# Altium project 218BProject.PrjPCB
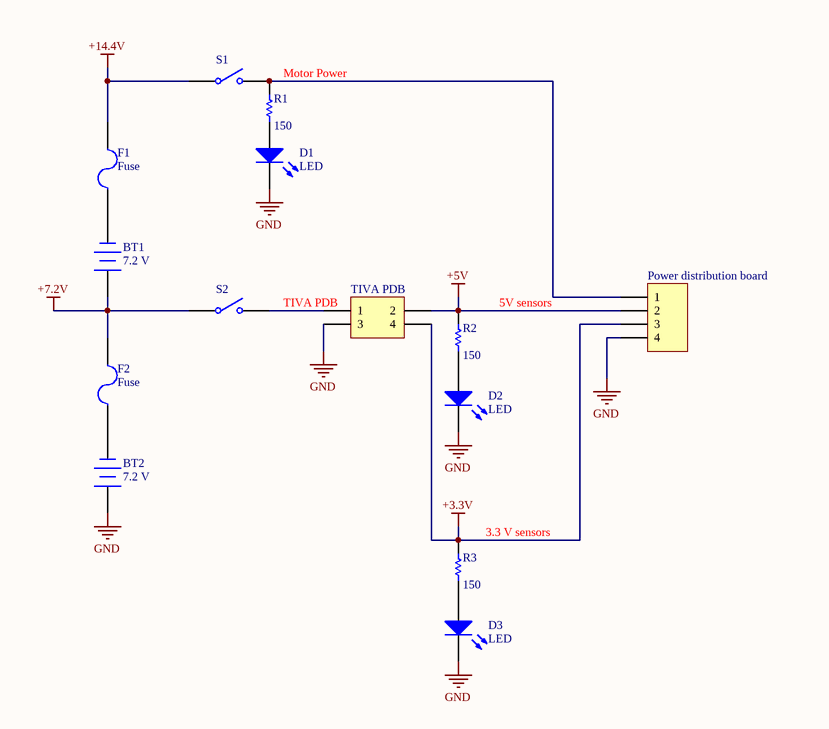
[diagram p0: Battery_supply.SchDoc]
9 sheets, 66 parts. Net scope: flat (ports and power ports of the same name join across sheets).
Sheets:
  Battery_supply.SchDoc
  Motordrive.SchDoc
  TIVA.SchDoc
  Color_sensor.SchDoc
  COMPASS.SchDoc
  Team_indication.SchDoc
  Collision_avoidance.SchDoc
  Moving_balls.SchDoc
  TapeSensing.SchDoc

## Sheet Battery_supply.SchDoc
size A

### Parts
(Parts that share a designator on the sheet are numbered #1, #2 ... from top to bottom, then left to right.)
BT1  7.2 V  [BAT-2]
BT2  7.2 V  [BAT-2]
D1  LED  [LED-1]
D2  LED  [LED-1]
D3  LED  [LED-1]
F1  Fuse  [PIN-W2/E2.8]
F2  Fuse  [PIN-W2/E2.8]
Power_distribution_board  Header 4  [HDR1X4]  (value not drawn)
R1#1  value 150  [AXIAL-0.3]  (hidden comment: Res1)
R2#1  value 150  [AXIAL-0.3]  (hidden comment: Res1)
R3#1  value 150  [AXIAL-0.3]  (hidden comment: Res1)
S1  (no value)  [SPST-2]
S2  (no value)  [SPST-2]
TIVA_PDB  Header 2X2  [HDR2X2]  (value not drawn)

### Nets
+3.3V: Power_distribution_board.3 R3#1.2 TIVA_PDB.4
+5V: Power_distribution_board.2 R2#1.2 TIVA_PDB.2
+7.2V: BT1.1(+) F2.2 S2.1(COMMON)
+14.4V: F1.2 S1.1(COMMON)
GND: BT2.1(+) D1.2(K) D2.2(K) D3.2(K) Power_distribution_board.4 TIVA_PDB.3
NetBT1_2: BT1.2(-) F1.1
NetBT2_2: BT2.2(-) F2.1
NetD2_1: D2.1(A) R2#1.1
NetD3_1: D3.1(A) R3#1.1
NetPower_distribution_board_1: Power_distribution_board.1 R1#1.2 S1.2(NO)
NetS2_2: S2.2(NO) TIVA_PDB.1

Not connected (* = marked no-connect by the designer): D1 1(A); R1#1 1

### Notes on the sheet
- (near R1#1) Motor Power
- (near TIVA_PDB) TIVA PDB
- (near R2#1) 5V sensors
- (near R3#1) 3.3 V sensors

### Library data of the parts
BT1 BT2 = Battery: Multicell Battery; Published: 24-Mar-1999; LatestRevisionDate: 17-Jul-2002; LatestRevisionNote: Re-released for DXP Platform.; PackageReference: BAT-2; Publisher: Altium Limited; PackageDescription: Battery; 2 Leads
D1-D3 = LED1: Typical RED GaAs LED; Published: 8-Jun-2000; LatestRevisionDate: 08-Jul-2005; LatestRevisionNote: Mech Layer 1 removed.; PackageReference: LED-1; Publisher: Altium Limited; PackageDescription: LED; 2 Leads
F1 F2 = Fuse 2: Published: 8-Jun-2000; LatestRevisionDate: 17-Jul-2002; LatestRevisionNote: Re-released for DXP Platform.; PackageReference: PIN-W2/E2.8; Publisher: Altium Limited; PackageDescription: Thru-Hole; 2 Leads
Power_distribution_board = Header 4: Header, 4-Pin; LatestRevisionDate: 17-Jul-2002; LatestRevisionNote: Re-released for DXP Platform.; Publisher: Altium Limited
R1#1 R2#1 R3#1 = Res1: Resistor; Published: 8-Jun-2000; LatestRevisionDate: 17-Jul-2002; LatestRevisionNote: Re-released for DXP Platform.; PackageReference: AXIAL-0.3; Publisher: Altium Limited; PackageDescription: Axial Device, Thru-Hole; 2 Leads; 0.3 in Pin Spacing
S1 S2 = SW-SPST: Single-Pole, Single-Throw Switch; Published: 24-Mar-1999; LatestRevisionDate: 17-Jul-2002; LatestRevisionNote: Re-released for DXP Platform.; PackageReference: SPST-2; Publisher: Altium Limited; PackageDescription: Switch; 2 Leads
TIVA_PDB = Header 2X2: Header, 2-Pin, Dual row; LatestRevisionDate: 17-Jul-2002; LatestRevisionNote: Re-released for DXP Platform.; Publisher: Altium Limited

## Sheet Motordrive.SchDoc
size A
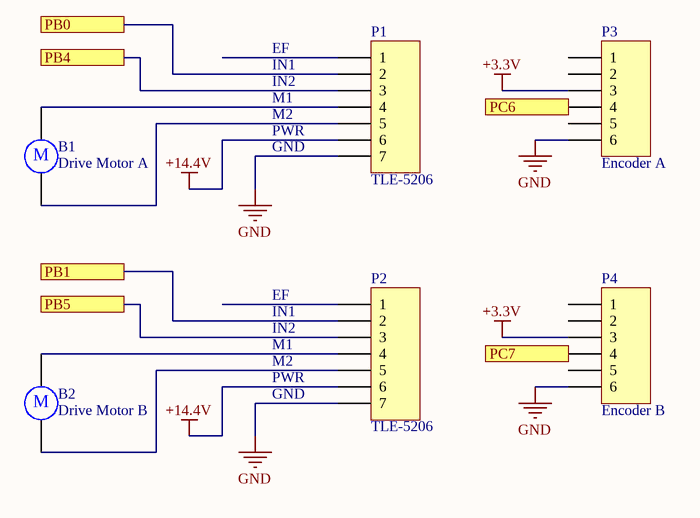
[diagram p1: Motordrive.SchDoc]

### Parts
B1  Drive Motor A  [RB5-10.5]
B2  Drive Motor B  [RB5-10.5]
P1  TLE-5206  [HDR1X7]
P2  TLE-5206  [HDR1X7]
P3  Encoder A  [HDR1X6]
P4  Encoder B  [HDR1X6]

### Ports
PB0, PB1, PB4, PB5, PC6, PC7

### Nets
+3.3V: P3.3 P4.3
+14.4V: P1.6 P2.6
GND: P1.7 P2.7 P3.6 P4.6
NetB1_1: B1.1 P1.4
NetB1_2: B1.2 P1.5
NetB2_1: B2.1 P2.4
NetB2_2: B2.2 P2.5
NetP1_2: P1.2 ; port PB0
NetP1_3: P1.3 ; port PB4
NetP2_2: P2.2 ; port PB1
NetP2_3: P2.3 ; port PB5
NetP3_4: P3.4 ; port PC6
NetP4_4: P4.4 ; port PC7

Not connected (* = marked no-connect by the designer): P1 1; P2 1; P3 1 2 5; P4 1 2 5

### Notes on the sheet
- EF
- IN1
- IN2
- M1
- M2
- PWR
- GND
- (in symbol Motor) M

### Library data of the parts
B1 B2 = Motor: Motor, General Kind; Manufacturer: Generic Components; Published: 1999
P1 P2 = Header 7: Header, 7-Pin; LatestRevisionDate: 17-Jul-2002; LatestRevisionNote: Re-released for DXP Platform.; Publisher: Altium Limited
P3 P4 = Header 6: Header, 6-Pin; LatestRevisionDate: 17-Jul-2002; LatestRevisionNote: Re-released for DXP Platform.; Publisher: Altium Limited

## Sheet TIVA.SchDoc
size A
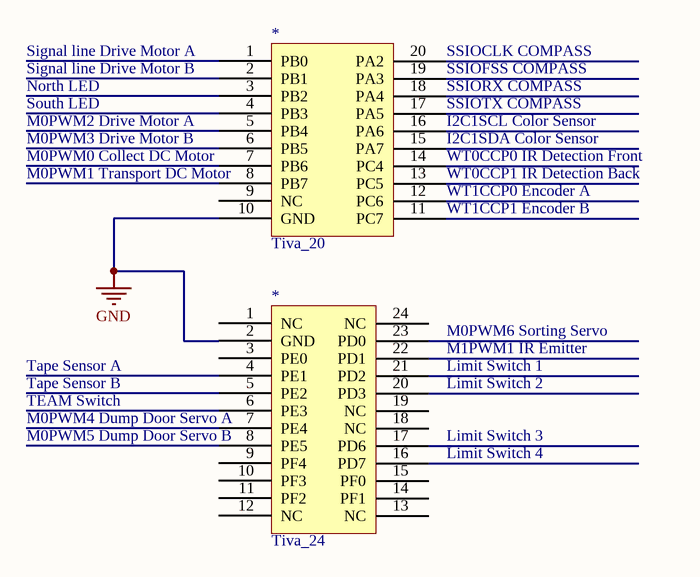
[diagram p2: TIVA.SchDoc]

### Parts
(Parts that share a designator on the sheet are numbered #1, #2 ... from top to bottom, then left to right.)
*#1  Tiva_20
*#2  Tiva_24

### Nets
GND: *#1.10(GND) *#2.2(GND)

Not connected (* = marked no-connect by the designer): *#1 1(PB0) 2(PB1) 3(PB2) 4(PB3) 5(PB4) 6(PB5) 7(PB6) 8(PB7) 9(NC) 11(PC7) 12(PC6) 13(PC5) 14(PC4) 15(PA7) 16(PA6) 17(PA5) 18(PA4) 19(PA3) 20(PA2); *#2 1(NC) 3(PE0) 4(PE1) 5(PE2) 6(PE3) 7(PE4) 8(PE5) 9(PF4) 10(PF3) 11(PF2) 12(NC) 13(NC) 14(PF1) 15(PF0) 16(PD7) 17(PD6) 18(NC) 19(NC) 20(PD3) 21(PD2) 22(PD1) 23(PD0) 24(NC)

### Notes on the sheet
- (near *#1) Signal line Drive Motor A
- (near *#1) Signal line Drive Motor B
- North LED
- (near *#1) SSIORX COMPASS
- (near *#1) SSIOFSS COMPASS
- (near *#1) SSIOCLK COMPASS
- South LED
- M0PWM2 Drive Motor A
- M0PWM3 Drive Motor B
- (near *#1) M0PWM0 Collect DC Motor
- (near *#1) M0PWM1 Transport DC Motor
- (near *#1) WT0CCP1 IR Detection Back
- (near *#1) WT0CCP0 IR Detection Front
- (near *#1) I2C1SDA Color Sensor
- (near *#1) SSIOTX COMPASS
- (near *#1) I2C1SCL Color Sensor
- (near *#1) WT1CCP1 Encoder B
- (near *#1) WT1CCP0 Encoder A
- M0PWM6 Sorting Servo
- M1PWM1 IR Emitter
- (near *#2) M0PWM4 Dump Door Servo A
- (near *#2) M0PWM5 Dump Door Servo B
- Tape Sensor A
- Tape Sensor B
- TEAM Switch
- Limit Switch 1
- Limit Switch 2
- Limit Switch 3
- Limit Switch 4

### Library data of the parts
*#1 = Tiva_20: Tiva Protection 20 Pin Connector
*#2 = Tiva_24: Tiva Protection 24 Pin Connector

## Sheet Color_sensor.SchDoc
size A
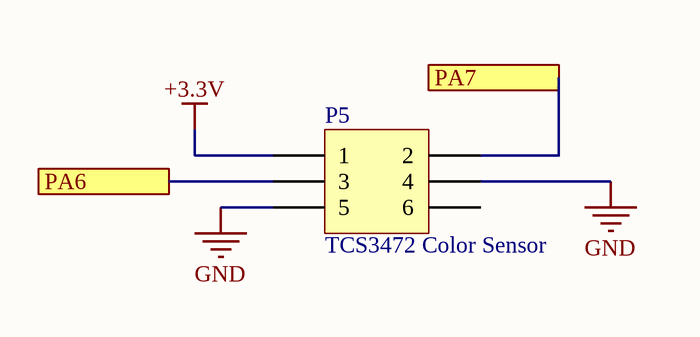
[diagram p3: Color_sensor.SchDoc]

### Parts
P5  TCS3472 Color Sensor  [HDR2X3]

### Ports
PA6, PA7

### Nets
+3.3V: P5.1
GND: P5.4 P5.5
NetP5_2: P5.2 ; port PA7
NetP5_3: P5.3 ; port PA6

Not connected (* = marked no-connect by the designer): P5 6

### Library data of the parts
P5 = Header 3X2: Header, 3-Pin, Dual row; LatestRevisionDate: 17-Jul-2002; LatestRevisionNote: Re-released for DXP Platform.; Publisher: Altium Limited

## Sheet COMPASS.SchDoc
size A
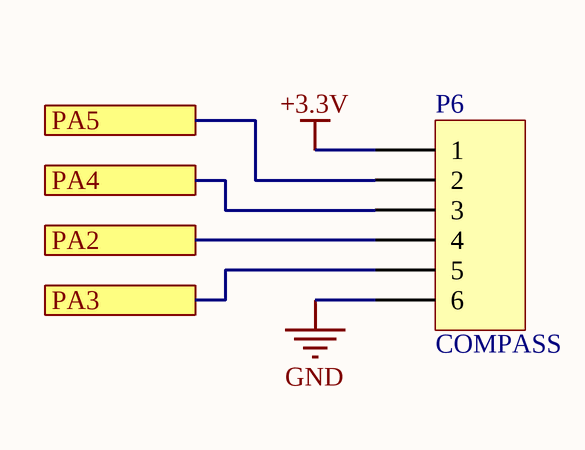
[diagram p4: COMPASS.SchDoc]

### Parts
P6  COMPASS  [HDR1X6]

### Ports
PA2, PA3, PA4, PA5

### Nets
+3.3V: P6.1
GND: P6.6
NetP6_2: P6.2 ; port PA5
NetP6_3: P6.3 ; port PA4
NetP6_4: P6.4 ; port PA2
NetP6_5: P6.5 ; port PA3

### Library data of the parts
P6 = Header 6: Header, 6-Pin; LatestRevisionDate: 17-Jul-2002; LatestRevisionNote: Re-released for DXP Platform.; Publisher: Altium Limited

## Sheet Team_indication.SchDoc
size A
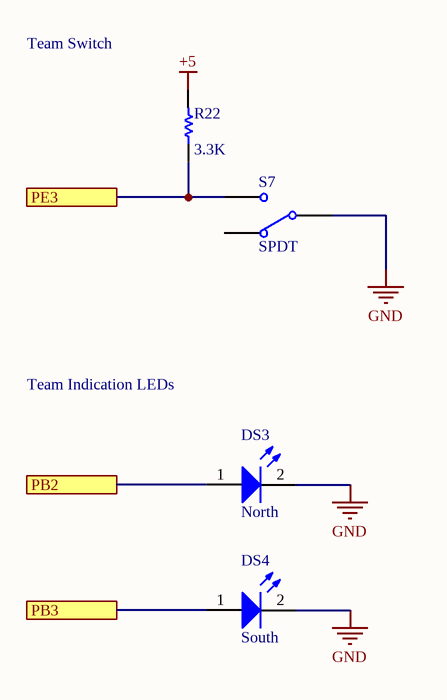
[diagram p5: Team_indication.SchDoc]

### Parts
(Parts that share a designator on the sheet are numbered #1, #2 ... from top to bottom, then left to right.)
DS3#1  North  [LED-1]
DS4  South  [LED-1]
R22  value 3.3K  [AXIAL-0.3]  (hidden comment: Res1)
S7  SPDT  [SPDT-3]

### Ports
PB2, PB3, PE3

### Nets
+5: R22.2
GND: DS3#1.2(K) DS4.2(K) S7.1(COMMON)
NetDS3#1_1: DS3#1.1(A) ; port PB2
NetDS4_1: DS4.1(A) ; port PB3
NetR22_1: R22.1 S7.3(NO) ; port PE3

Not connected (* = marked no-connect by the designer): S7 2(NC)

### Notes on the sheet
- Team Switch
- Team Indication LEDs

### Library data of the parts
DS3#1 DS4 = LED1: Typical RED GaAs LED; Manufacturer: Generic Components; Class: Optoelectronic; Published: 08/06/2000; Publisher: Altium Hobart Technology Centre; SubClass: LED
R22 = Res1: Resistor; Manufacturer: Generic Components; Class: Passive; Published: 08/06/2000; Publisher: Altium Hobart Technology Centre; SubClass: Resistor
S7 = SW-SPDT: Single-Pole, Double-Throw Switch; Manufacturer: Generic Components; Published: 1999

## Sheet Collision_avoidance.SchDoc
size A
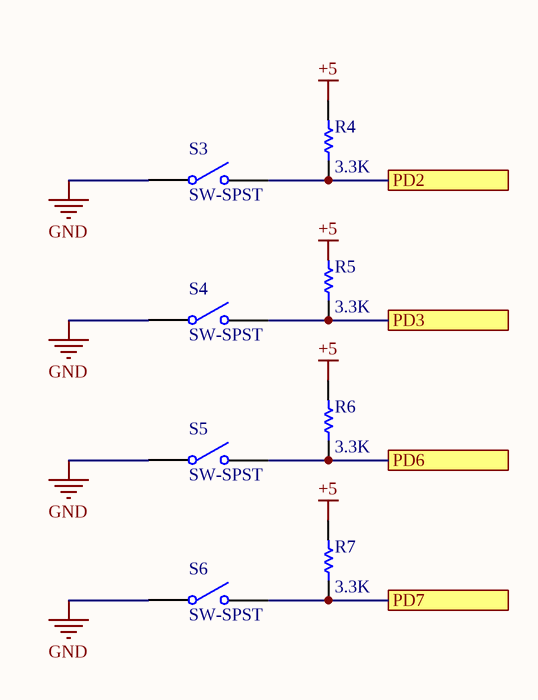
[diagram p6: Collision_avoidance.SchDoc]

### Parts
(Parts that share a designator on the sheet are numbered #1, #2 ... from top to bottom, then left to right.)
R4#1  value 3.3K  [AXIAL-0.3]  (hidden comment: Res1)
R5#1  value 3.3K  [AXIAL-0.3]  (hidden comment: Res1)
R6  value 3.3K  [AXIAL-0.3]  (hidden comment: Res1)
R7  value 3.3K  [AXIAL-0.3]  (hidden comment: Res1)
S3  SW-SPST  [SPST-2]
S4  SW-SPST  [SPST-2]
S5  SW-SPST  [SPST-2]
S6  SW-SPST  [SPST-2]

### Ports
PD2, PD3, PD6, PD7

### Nets
+5: R4#1.2 R6.2 R7.2
GND: S3.1(COMMON) S4.1(COMMON) S5.1(COMMON) S6.1(COMMON)
NetR4#1_1: R4#1.1 S3.2(NO) ; port PD2
NetR5#1_1: R5#1.1 S4.2(NO) ; port PD3
NetR6_1: R6.1 S5.2(NO) ; port PD6
NetR7_1: R7.1 S6.2(NO) ; port PD7

Not connected (* = marked no-connect by the designer): R5#1 2

### Notes on the sheet
- Labels drawn without touching a wire or pin: +5

### Library data of the parts
R4#1 R5#1 R6 R7 = Res1: Resistor; Published: 8-Jun-2000; LatestRevisionDate: 17-Jul-2002; LatestRevisionNote: Re-released for DXP Platform.; PackageReference: AXIAL-0.3; Publisher: Altium Limited; PackageDescription: Axial Device, Thru-Hole; 2 Leads; 0.3 in Pin Spacing
S3-S6 = SW-SPST: Single-Pole, Single-Throw Switch; Published: 24-Mar-1999; LatestRevisionDate: 17-Jul-2002; LatestRevisionNote: Re-released for DXP Platform.; PackageReference: SPST-2; Publisher: Altium Limited; PackageDescription: Switch; 2 Leads

## Sheet Moving_balls.SchDoc
size A
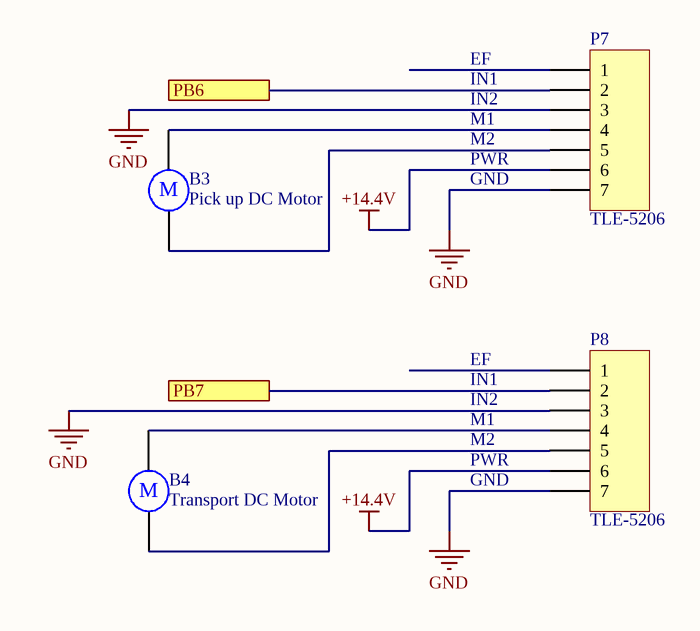
[diagram p7: Moving_balls.SchDoc]

### Parts
B3  Pick up DC Motor  [RB5-10.5]
B4  Transport DC Motor  [RB5-10.5]
P7  TLE-5206  [HDR1X7]
P8  TLE-5206  [HDR1X7]

### Ports
PB6, PB7

### Nets
+14.4V: P7.6 P8.6
GND: P7.3 P7.7 P8.3 P8.7
NetB3_1: B3.1 P7.4
NetB3_2: B3.2 P7.5
NetB4_1: B4.1 P8.4
NetB4_2: B4.2 P8.5
NetP7_2: P7.2 ; port PB6
NetP8_2: P8.2 ; port PB7

Not connected (* = marked no-connect by the designer): P7 1; P8 1

### Notes on the sheet
- EF
- IN1
- IN2
- M1
- M2
- PWR
- GND
- (in symbol Motor) M

### Library data of the parts
B3 B4 = Motor: as B1 on sheet Motordrive; Published: 1999
P7 P8 = Header 7: Header, 7-Pin; LatestRevisionDate: 17-Jul-2002; LatestRevisionNote: Re-released for DXP Platform.; Publisher: Altium Limited

## Sheet TapeSensing.SchDoc
size A
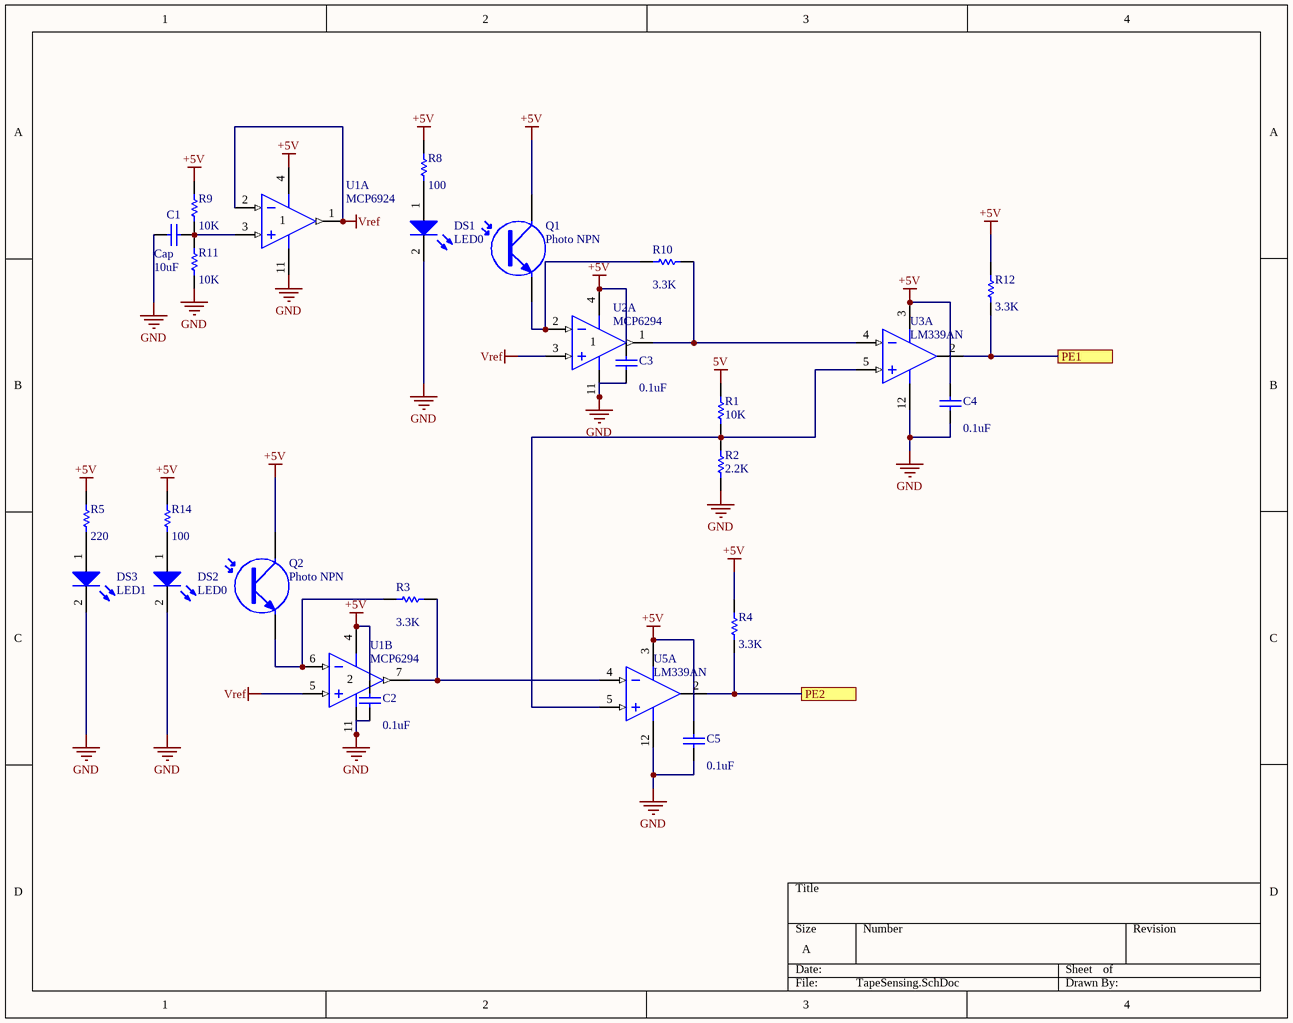
[diagram p8: TapeSensing.SchDoc]

### Parts
(Parts that share a designator on the sheet are numbered #1, #2 ... from top to bottom, then left to right.)
C1  Cap  value 10uF  [RAD-0.3]
C2  value 0.1uF  [RAD-0.3]  (hidden comment: BypassCap)
C3  value 0.1uF  [RAD-0.3]  (hidden comment: BypassCap)
C4  value 0.1uF  [RAD-0.3]  (hidden comment: BypassCap)
C5  value 0.1uF  [RAD-0.3]  (hidden comment: BypassCap)
DS1  LED0  [LED-0]
DS2  LED0  [LED-0]
DS3#2  LED1  [LED-1]
Q1  Photo NPN  [SFM-T2(3)/X1.6V]
Q2  Photo NPN  [SFM-T2(3)/X1.6V]
R1#2  value 10K  [AXIAL-0.3]  (hidden comment: Res1)
R2#2  value 2.2K  [AXIAL-0.3]  (hidden comment: Res1)
R3#2  value 3.3K  [AXIAL-0.3]  (hidden comment: Res1)
R4#2  value 3.3K  [AXIAL-0.3]  (hidden comment: Res1)
R5#2  value 220  [AXIAL-0.3]  (hidden comment: Res1)
R8  value 100  [AXIAL-0.3]  (hidden comment: Res1)
R9  value 10K  [AXIAL-0.3]  (hidden comment: Res1)
R10  value 3.3K  [AXIAL-0.3]  (hidden comment: Res1)
R11  value 10K  [AXIAL-0.3]  (hidden comment: Res1)
R12  value 3.3K  [AXIAL-0.3]  (hidden comment: Res1)
R14  value 100  [AXIAL-0.3]  (hidden comment: Res1)
U1#1  MCP6924  [DIP-14]  (part A of 4)
U1#2  MCP6294  [DIP-14/D19.7]  (part B of 4)
U2  MCP6294  [DIP-14/D19.7]  (part A of 4)
U3  LM339AN  [DIP-14/D19.7]  (part A of 4)
U5  LM339AN  [DIP-14/D19.7]  (part A of 4)

### Ports
PE1, PE2

### Nets
5V: R1#2.1
+5V: C2.1 C3.1 C4.1 C5.1 Q1.1(C) Q2.1(C) R4#2.2 R5#2.2 R8.2 R9.2 R12.2 R14.2 U1#1.4(V+) U1#2.4(V+) U2.4(V+) U3.3(V+) U5.3(V+)
GND: C1.1 C2.2 C3.2 C4.2 C5.2 DS1.2(K) DS2.2(K) DS3#2.2(K) R2#2.2 R11.1 U1#1.11(GND) U1#2.11(V-) U2.11(V-) U3.12(GND) U5.12(GND)
Vref: U1#1.1(OUT) U1#1.2(IN-) U1#2.5(IN+) U2.3(IN+)
NetC1_2: C1.2 R9.1 R11.2 U1#1.3(IN+)
NetDS1_1: DS1.1(A) R8.1
NetDS2_1: DS2.1(A) R14.1
NetDS3#2_1: DS3#2.1(A) R5#2.1
NetQ1_3: Q1.3(E) R10.1 U2.2(IN-)
NetQ2_3: Q2.3(E) R3#2.1 U1#2.6(IN-)
NetR1#2_2: R1#2.2 R2#2.1 U3.5(IN+) U5.5(IN+)
NetR3#2_2: R3#2.2 U1#2.7(OUT) U5.4(IN-)
NetR4#2_1: R4#2.1 U5.2(OUT) ; port PE2
NetR10_2: R10.2 U2.1(OUT) U3.4(IN-)
NetR12_1: R12.1 U3.2(OUT) ; port PE1

### Library data of the parts
C1-C5 = Cap: Capacitor; Manufacturer: Generic Components; Class: Passive; Published: 08/06/2000; Publisher: Altium Hobart Technology Centre; SubClass: Capacitor
DS1 DS2 = LED0: Typical INFRARED GaAs LED; Manufacturer: Generic Components; Class: Optoelectronic; Published: 08/06/2000; Publisher: Altium Hobart Technology Centre; SubClass: LED
DS3#2 = LED1: as DS3#1 on sheet Team_indication; Published: 08/06/2000; Publisher: Altium Hobart Technology Centre; SubClass: LED
Q1 Q2 = Photo NPN: NPN Phototransistor; Manufacturer: Generic Components; Class: Optoelectronic; Published: 1999
R1#2 R2#2 R3#2 R4#2 R5#2 R8-R12 R14 = Res1: as R22 on sheet Team_indication; Published: 08/06/2000; Publisher: Altium Hobart Technology Centre; SubClass: Resistor
U1#1 = LM324AJ: Low-Power Quad Operational Amplifier; Manufacturer: National Semiconductor; Published: 15/04/2002; Publisher: Altium Hobart Technology Centre; Class: Amplifier; SubClass: Operational Amplifier
U1#2 U2 = MCP6294: Quad 1Ma 10MHz Rail-to-Rail I/O Operational Amplifier; Manufacturer: National Semiconductor; Published: 15/04/2002; Publisher: Altium Hobart Technology Centre; Class: Amplifier; SubClass: Operational Amplifier
U3 U5 = LM339AN: Quad Single-Supply Comparator; Manufacturer: Motorola; Class: Analog; Published: 15/04/2002; Publisher: Altium Hobart Technology Centre; SubClass: Comparator

## Nets that join several sheets
+3.3V: Battery_supply (Power_distribution_board.3 R3#1.2 TIVA_PDB.4), Motordrive (P3.3 P4.3), Color_sensor (P5.1), COMPASS (P6.1)
+5: Team_indication (R22.2), Collision_avoidance (R4#1.2 R6.2 R7.2)
+5V: Battery_supply (Power_distribution_board.2 R2#1.2 TIVA_PDB.2), TapeSensing (17 pins)
+14.4V: Battery_supply (F1.2 S1.1), Motordrive (P1.6 P2.6), Moving_balls (P7.6 P8.6)
GND: Battery_supply (6 pins), Motordrive (P1.7 P2.7 P3.6 P4.6), TIVA (*#1.10 *#2.2), Color_sensor (P5.4 P5.5), COMPASS (P6.6), Team_indication (DS3#1.2 DS4.2 S7.1), Collision_avoidance (S3.1 S4.1 S5.1 S6.1), Moving_balls (P7.3 P7.7 P8.3 P8.7), TapeSensing (15 pins)